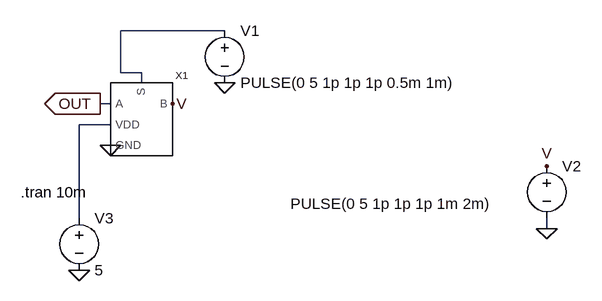
[diagram p0: schematic pmos_gate_test.asc]
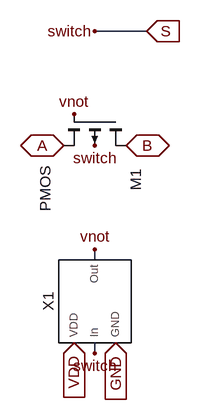
[diagram p1: sub-circuit gate_pmos.asc]
pmos_gate_test.asc, the LTspice schematic file:
Version 4
SHEET 1 888 680
WIRE 336 48 176 48
WIRE 176 112 176 48
WIRE 208 112 176 112
WIRE 208 128 208 112
WIRE 160 160 144 160
WIRE 160 192 112 192
WIRE 112 336 112 192
WIRE 832 352 832 336
FLAG 336 128 0
FLAG 832 352 0
FLAG 144 160 OUT
IOPIN 144 160 Out
FLAG 160 224 0
FLAG 112 416 0
FLAG 832 256 V
FLAG 256 160 V
SYMBOL voltage 336 32 R0
WINDOW 123 0 0 Left 0
WINDOW 39 0 0 Left 0
SYMATTR InstName V1
SYMATTR Value PULSE(0 5 1p 1p 1p 0.5m 1m)
SYMBOL voltage 832 240 R0
WINDOW 3 -395 74 Left 2
WINDOW 123 0 0 Left 0
WINDOW 39 0 0 Left 0
SYMATTR InstName V2
SYMATTR Value PULSE(0 5 1p 1p 1p 1m 2m)
SYMBOL gate_pmos 208 176 R0
SYMATTR InstName X1
SYMBOL voltage 112 320 R0
SYMATTR InstName V3
SYMATTR Value 5
TEXT 22 296 Left 2 !.tran 10m

gate_pmos.asc, the sub-circuit schematic file:
Version 4
SHEET 1 936 680
WIRE 464 -240 384 -240
WIRE 384 112 384 96
WIRE 384 256 384 240
FLAG 384 96 vnot
FLAG 384 -240 switch
FLAG 352 -112 vnot
FLAG 336 -64 A
IOPIN 336 -64 BiDir
FLAG 432 -64 B
IOPIN 432 -64 BiDir
FLAG 464 -240 S
IOPIN 464 -240 In
FLAG 384 -64 switch
FLAG 384 256 switch
FLAG 352 240 VDD
IOPIN 352 240 In
FLAG 416 240 GND
IOPIN 416 240 In
SYMBOL NOT 384 176 R270
SYMATTR InstName X1
SYMBOL pmos4 432 -112 R90
WINDOW 0 84 -15 Left 2
WINDOW 3 80 124 Left 2
SYMATTR InstName M1

The netlist it stands for:
* pmos_gate_test.asc
V1 N001 0 PULSE(0 5 1p 1p 1p 0.5m 1m)
V2 V 0 PULSE(0 5 1p 1p 1p 1m 2m)
XX1 0 N001 N002 OUT V gate_pmos
V3 N002 0 5

* block symbol definitions
.subckt gate_pmos GND S VDD A B
XX1 GND S VDD vnot NOT  ; pins GND In VDD Out
M1 B vnot A S PMOS
.ends gate_pmos

.model NMOS NMOS
.model PMOS PMOS
.lib standard.mos
.tran 10m
.backanno
.end

* Results of the author's LTspice run, read from the files saved beside the schematic
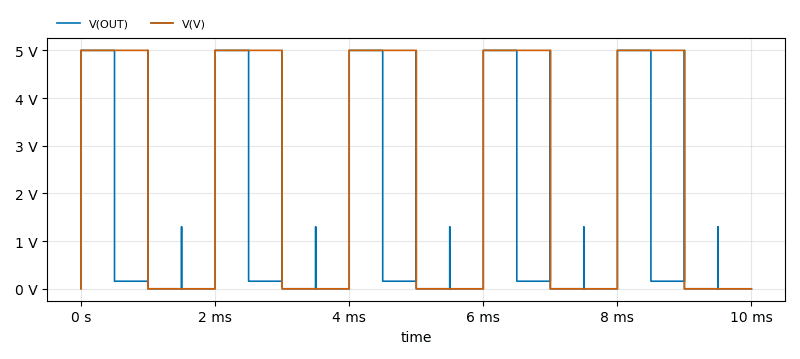
[diagram p2: Transient Analysis of pmos_gate_test.asc, plotted from the saved traces]
* Transient Analysis, 1 run:
*   V(OUT): min 0 V, max 5 V, average 1.29 V, rms 2.501 V, last 0 V
*   V(V): min 0 V, max 5 V, average 2.5 V, rms 3.536 V, last 0 V